# Altium schematic sheet modFOC-Motion_Controller_2.0.SchDoc
size A4; Engineer: hallo; Address1: modFOC; Revision: 2.0; SheetNumber: 1
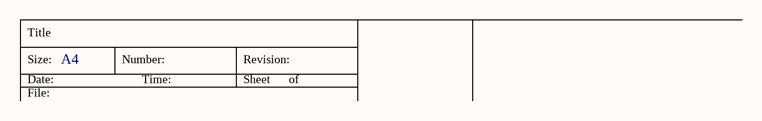
[diagram p0: modFOC-Motion_Controller_2.0.SchDoc]

## Notes on the sheet
- Title
- Size:
- Date:
- A4
- Number:
- Time:
- Revision:
- Sheet
- of
- File: